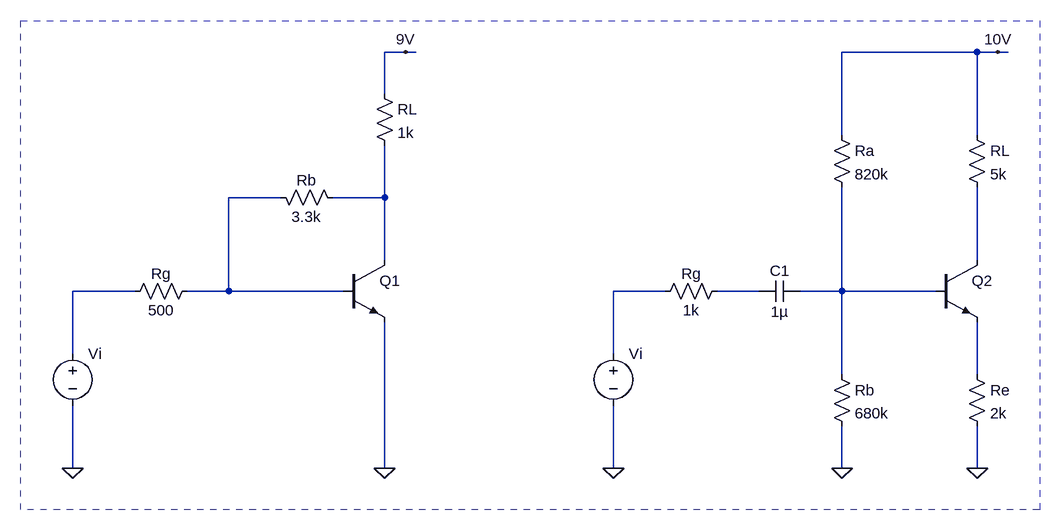
[diagram p0: schematic ej1-10a.asc]
ej1-10a.asc, the LTspice schematic file:
Version 4
SHEET 1 7076 6404
WIRE 592 48 560 48
WIRE 608 48 592 48
WIRE 1472 48 1264 48
WIRE 1504 48 1472 48
WIRE 1520 48 1504 48
WIRE 560 112 560 48
WIRE 1264 176 1264 48
WIRE 1472 176 1472 48
WIRE 400 272 320 272
WIRE 560 272 560 192
WIRE 560 272 480 272
WIRE 560 368 560 272
WIRE 1472 368 1472 256
WIRE 176 416 80 416
WIRE 320 416 320 272
WIRE 320 416 256 416
WIRE 496 416 320 416
WIRE 992 416 912 416
WIRE 1136 416 1072 416
WIRE 1264 416 1264 256
WIRE 1264 416 1200 416
WIRE 1408 416 1264 416
WIRE 80 512 80 416
WIRE 912 512 912 416
WIRE 1264 544 1264 416
WIRE 1472 544 1472 464
WIRE 80 688 80 592
WIRE 560 688 560 464
WIRE 912 688 912 592
WIRE 1264 688 1264 624
WIRE 1472 688 1472 624
FLAG 560 688 0
FLAG 80 688 0
FLAG 592 48 9V
FLAG 912 688 0
FLAG 1504 48 10V
FLAG 1472 688 0
FLAG 1264 688 0
SYMBOL npn 496 368 R0
WINDOW 3 56 68 Invisible 2
SYMATTR InstName Q1
SYMBOL res 496 288 M270
WINDOW 0 27 56 VTop 2
WINDOW 3 2 56 VBottom 2
SYMATTR InstName Rb
SYMATTR Value 3.3k
SYMBOL res 160 432 R270
WINDOW 0 27 56 VTop 2
WINDOW 3 2 56 VBottom 2
SYMATTR InstName Rg
SYMATTR Value 500
SYMBOL voltage 80 496 R0
WINDOW 3 24 96 Invisible 2
SYMATTR InstName Vi
SYMBOL res 544 96 R0
SYMATTR InstName RL
SYMATTR Value 1k
SYMBOL npn 1408 368 R0
WINDOW 3 56 68 Invisible 2
SYMATTR InstName Q2
SYMBOL res 976 432 R270
WINDOW 0 27 56 VTop 2
WINDOW 3 2 56 VBottom 2
SYMATTR InstName Rg
SYMATTR Value 1k
SYMBOL voltage 912 496 R0
WINDOW 3 24 96 Invisible 2
SYMATTR InstName Vi
SYMBOL res 1456 160 R0
SYMATTR InstName RL
SYMATTR Value 5k
SYMBOL res 1456 528 R0
SYMATTR InstName Re
SYMATTR Value 2k
SYMBOL res 1248 528 R0
SYMATTR InstName Rb
SYMATTR Value 680k
SYMBOL res 1248 160 R0
SYMATTR InstName Ra
SYMATTR Value 820k
SYMBOL cap 1136 432 R270
WINDOW 0 32 32 VTop 2
WINDOW 3 0 32 VBottom 2
SYMATTR InstName C1
SYMATTR Value 1µ
RECTANGLE Normal 1568 752 0 0 2

The netlist it stands for:
* ej1-10a.asc
Q1 N002 N001 0 0 NPN
Rb N002 N001 3.3k
Rg N004 N001 500
Vi N004 0 V
RL 9V N002 1k
Q2 N003 N007 N008 0 NPN
Rg N005 N006 1k
Vi N005 0 V
RL 10V N003 5k
Re N008 0 2k
Rb N007 0 680k
Ra 10V N007 820k
C1 N006 N007 1µ
.model NPN NPN
.model PNP PNP
.lib standard.bjt
.backanno
.end